# Altium schematic sheet ECB01-Kit-V1.0.SchDoc
size A4
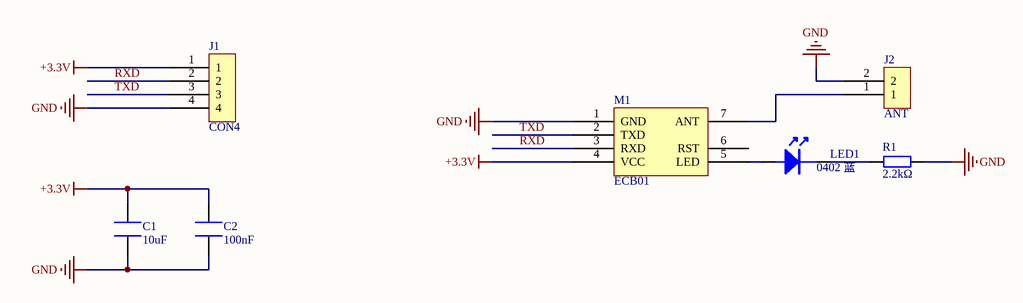
[diagram p0: ECB01-Kit-V1.0.SchDoc]

## Parts
C1  10uF  [0402]
C2  100nF  [0402]
J1  CON4  [SIP04]
J2  ANT  [SMA]
LED1  0402 蓝  [0402-led]
M1  ECB01  [ECB01]
R1  2.2kΩ  [0402]

## Nets
+3.3V: C1.2 C2.2 J1.1 M1.4(VCC)
GND: C1.1 C2.1 J1.4 J2.2 M1.1(GND) R1.2
RXD: J1.2 M1.3(RXD)
TXD: J1.3 M1.2(TXD)
NetJ2_1: J2.1 M1.7(ANT)
NetLED1_1: LED1.1 M1.5(LED)
NetLED1_2: LED1.2 R1.1

Not connected (* = marked no-connect by the designer): M1 6(RST)

## Library data of the parts
C1 C2 = C: 类型: 电容; 封装: 0402; 参数规格: *; 厂家: *; 厂家料号: *
LED1 = LED-0402: 封装: 0402; 类型: LED; 厂家: *; 厂家料号: *; 参数规格: *; 参考价格: *; 编号: *; 备注: *
R1 = R: 类型: 电阻; 厂家: *; 厂家料号: *; 封装: 0402; 参数规格: *; 参考价格: *; 编号: *; 备注: *